# Altium schematic sheet THS7001_PGA.SchDoc
size A4; SheetNumber: 5; SheetTotal: 7
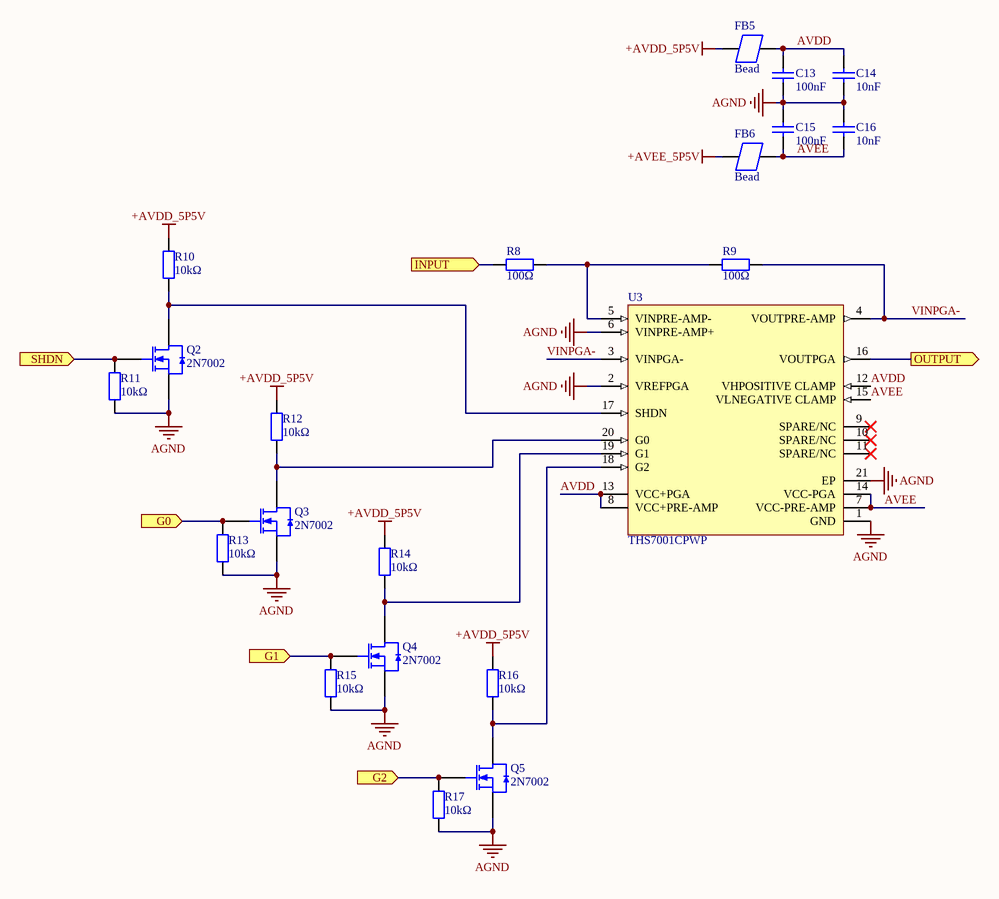
[diagram p0: THS7001_PGA.SchDoc]

## Parts
C13  100nF  [0603_C]
C14  10nF  [0603_C]
C15  100nF  [0603_C]
C16  10nF  [0603_C]
FB5  Bead  [0805_L]
FB6  Bead  [0805_L]
Q2  2N7002  [SOT-23(SOT-23-3)]
Q3  2N7002  [SOT-23(SOT-23-3)]
Q4  2N7002  [SOT-23(SOT-23-3)]
Q5  2N7002  [SOT-23(SOT-23-3)]
R8  100Ω  [0603_R]
R9  100Ω  [0603_R]
R10  10kΩ  [0603_R]
R11  10kΩ  [0603_R]
R12  10kΩ  [0603_R]
R13  10kΩ  [0603_R]
R14  10kΩ  [0603_R]
R15  10kΩ  [0603_R]
R16  10kΩ  [0603_R]
R17  10kΩ  [0603_R]
U3  THS7001CPWP  [PWP0020D_M]

## Ports
G0 (in), G1 (in), G2 (in), INPUT (in), OUTPUT (out), SHDN (in)

## Nets
+AVDD_5P5V: FB5.1 R10.2 R12.2 R14.2 R16.2
+AVEE_5P5V: FB6.1
AGND: C13.1 C14.1 C15.1 C16.1 Q2.2(S) Q3.2(S) Q4.2(S) Q5.2(S) R11.1 R13.1 R15.1 R17.1 U3.1(GND) U3.2(VREFPGA) U3.6(VINPRE-AMP+) U3.21(EP)
AVDD: C13.2 C14.2 FB5.2 U3.8(VCC+PRE-AMP) U3.12(VHPOSITIVE_CLAMP) U3.13(VCC+PGA)
AVEE: C15.2 C16.2 FB6.2 U3.7(VCC-PRE-AMP) U3.14(VCC-PGA) U3.15(VLNEGATIVE_CLAMP)
G0: Q3.1(G) R13.2 ; port G0
G1: Q4.1(G) R15.2 ; port G1
G2: Q5.1(G) R17.2 ; port G2
INPUT: R8.1 ; port INPUT
OUTPUT: U3.16(VOUTPGA) ; port OUTPUT
SHDN: Q2.1(G) R11.2 ; port SHDN
VINPGA-: R9.2 U3.3(VINPGA-) U3.4(VOUTPRE-AMP)
NetQ2_3: Q2.3(D) R10.1 U3.17(SHDN)
NetQ3_3: Q3.3(D) R12.1 U3.20(G0)
NetQ4_3: Q4.3(D) R14.1 U3.19(G1)
NetQ5_3: Q5.3(D) R16.1 U3.18(G2)
NetR8_2: R8.2 R9.1 U3.5(VINPRE-AMP-)

Not connected (* = marked no-connect by the designer): U3 9(SPARE/NC)* 10(SPARE/NC)* 11(SPARE/NC)*

## Library data of the parts
C13 C15 = 0603 100nF (104) 10% 50V: 贴片电容; ComponentLink1Description: 供应商链接; ComponentLink1URL: http://www.szlcsc.com/product/details_15331.html; Package: 0603; Supplier: LC; SuppliersPartNumber: C14663
C14 C16 = 0603 10nF (103) 10% 50V: 贴片电容; ComponentLink1Description: 供应商链接; ComponentLink1URL: http://www.szlcsc.com/product/details_58143.html; Package: 0603; Supplier: LC; SuppliersPartNumber: C57112
Q2-Q5 = 2N7002 7002: MOS(场效应管); ComponentLink1Description: 供应商链接; ComponentLink1URL: http://www.szlcsc.com/product/details_9040.html; Package: SOT-23(SOT-23-3); Supplier: LC; SuppliersPartNumber: C8545
R8 R9 = 0603 100Ω (1000) 1%: 贴片电阻; ComponentLink1Description: 供应商链接; ComponentLink1URL: http://www.szlcsc.com/product/details_23502.html; Package: 0603; Supplier: LC; SuppliersPartNumber: C22775
R10-R17 = 0603 10KΩ (1002) 1%: 贴片电阻; ComponentLink1Description: 供应商链接; ComponentLink1URL: http://www.szlcsc.com/product/details_26547.html; Package: 0603; Supplier: LC; SuppliersPartNumber: C25804
U3 = CMP-0988-00128-2: 70-MHz High-Speed Programmable-Gain Amplifier, 0 to 70 degC, 20-pin SOP (PWP20), Green (RoHS & no Sb/Br); Manufacturer: Texas Instruments; Disable: TRUE; Vio(Max)(mV): 7; SubFamily: Variable Gain Amplifier; Iib(Max)(nA): 6000; BW @ Acl(MHz): 100; Vn at Flatband(Typ)(nV/rtHz): 1.7; Slew Rate(Typ)(V/us): 85; Vs(Min)(V): 9; Number of Channels: 1; Vs(Max)(V): 32; ComponentLink1URL: http://www.ti.com/; ComponentLink2Description: Datasheet; ComponentLink3Description: Package Specification; PackageVersion: 4073225-4/I, 05/2011; PackageDescription: 20-Pin Plastic Small Outline, Body 4.4 x 6.5 mm, Pitch 0.65 mm; ComponentLink2URL: http://www.ti.com/general/docs/lit/getliterature.tsp?genericPartNumber=THS7001&fileType=pdf; Code_JEDEC: MO-153; Eco-Plan: Green (RoHS & no Sb/Br); DatasheetVersion: SLOS214C; ComponentLink1Description: Manufacturer URL; Mounting Technology: Surface Mount; ComponentLink3URL: http://www.ti.com/lit/ml/mhts001g/mhts001g.pdf; PartNumber: THS7001CPWP; PackageReference: PWP0020D